# Altium schematic sheet FPGA_EEM_FMC_HA.SchDoc: Phaser
size 420 x 297 mm; EDA_Number: ARTIQ; Projet: ARTIQ/SINARA; Author: G.Kasprowicz; CompanyName: WUT ISE; DrawnBy: G.Kasprowicz; Organization: WUT ISE; Address1: PW ISE; Address2: Nowowiejska 15/19 00-665 Warsaw; Address3: gkasprow@gmail.com; DocumentNumber: 4; Revision: 2; SheetNumber: 4; SheetTotal: 18; ModifiedBy: -; CheckedDate: -; Title2: FPGA ADC; DivGrp: WUT ISE; Designer: G.Kasprowicz; ModifiedDate: -; ProjectName: Sensor Box
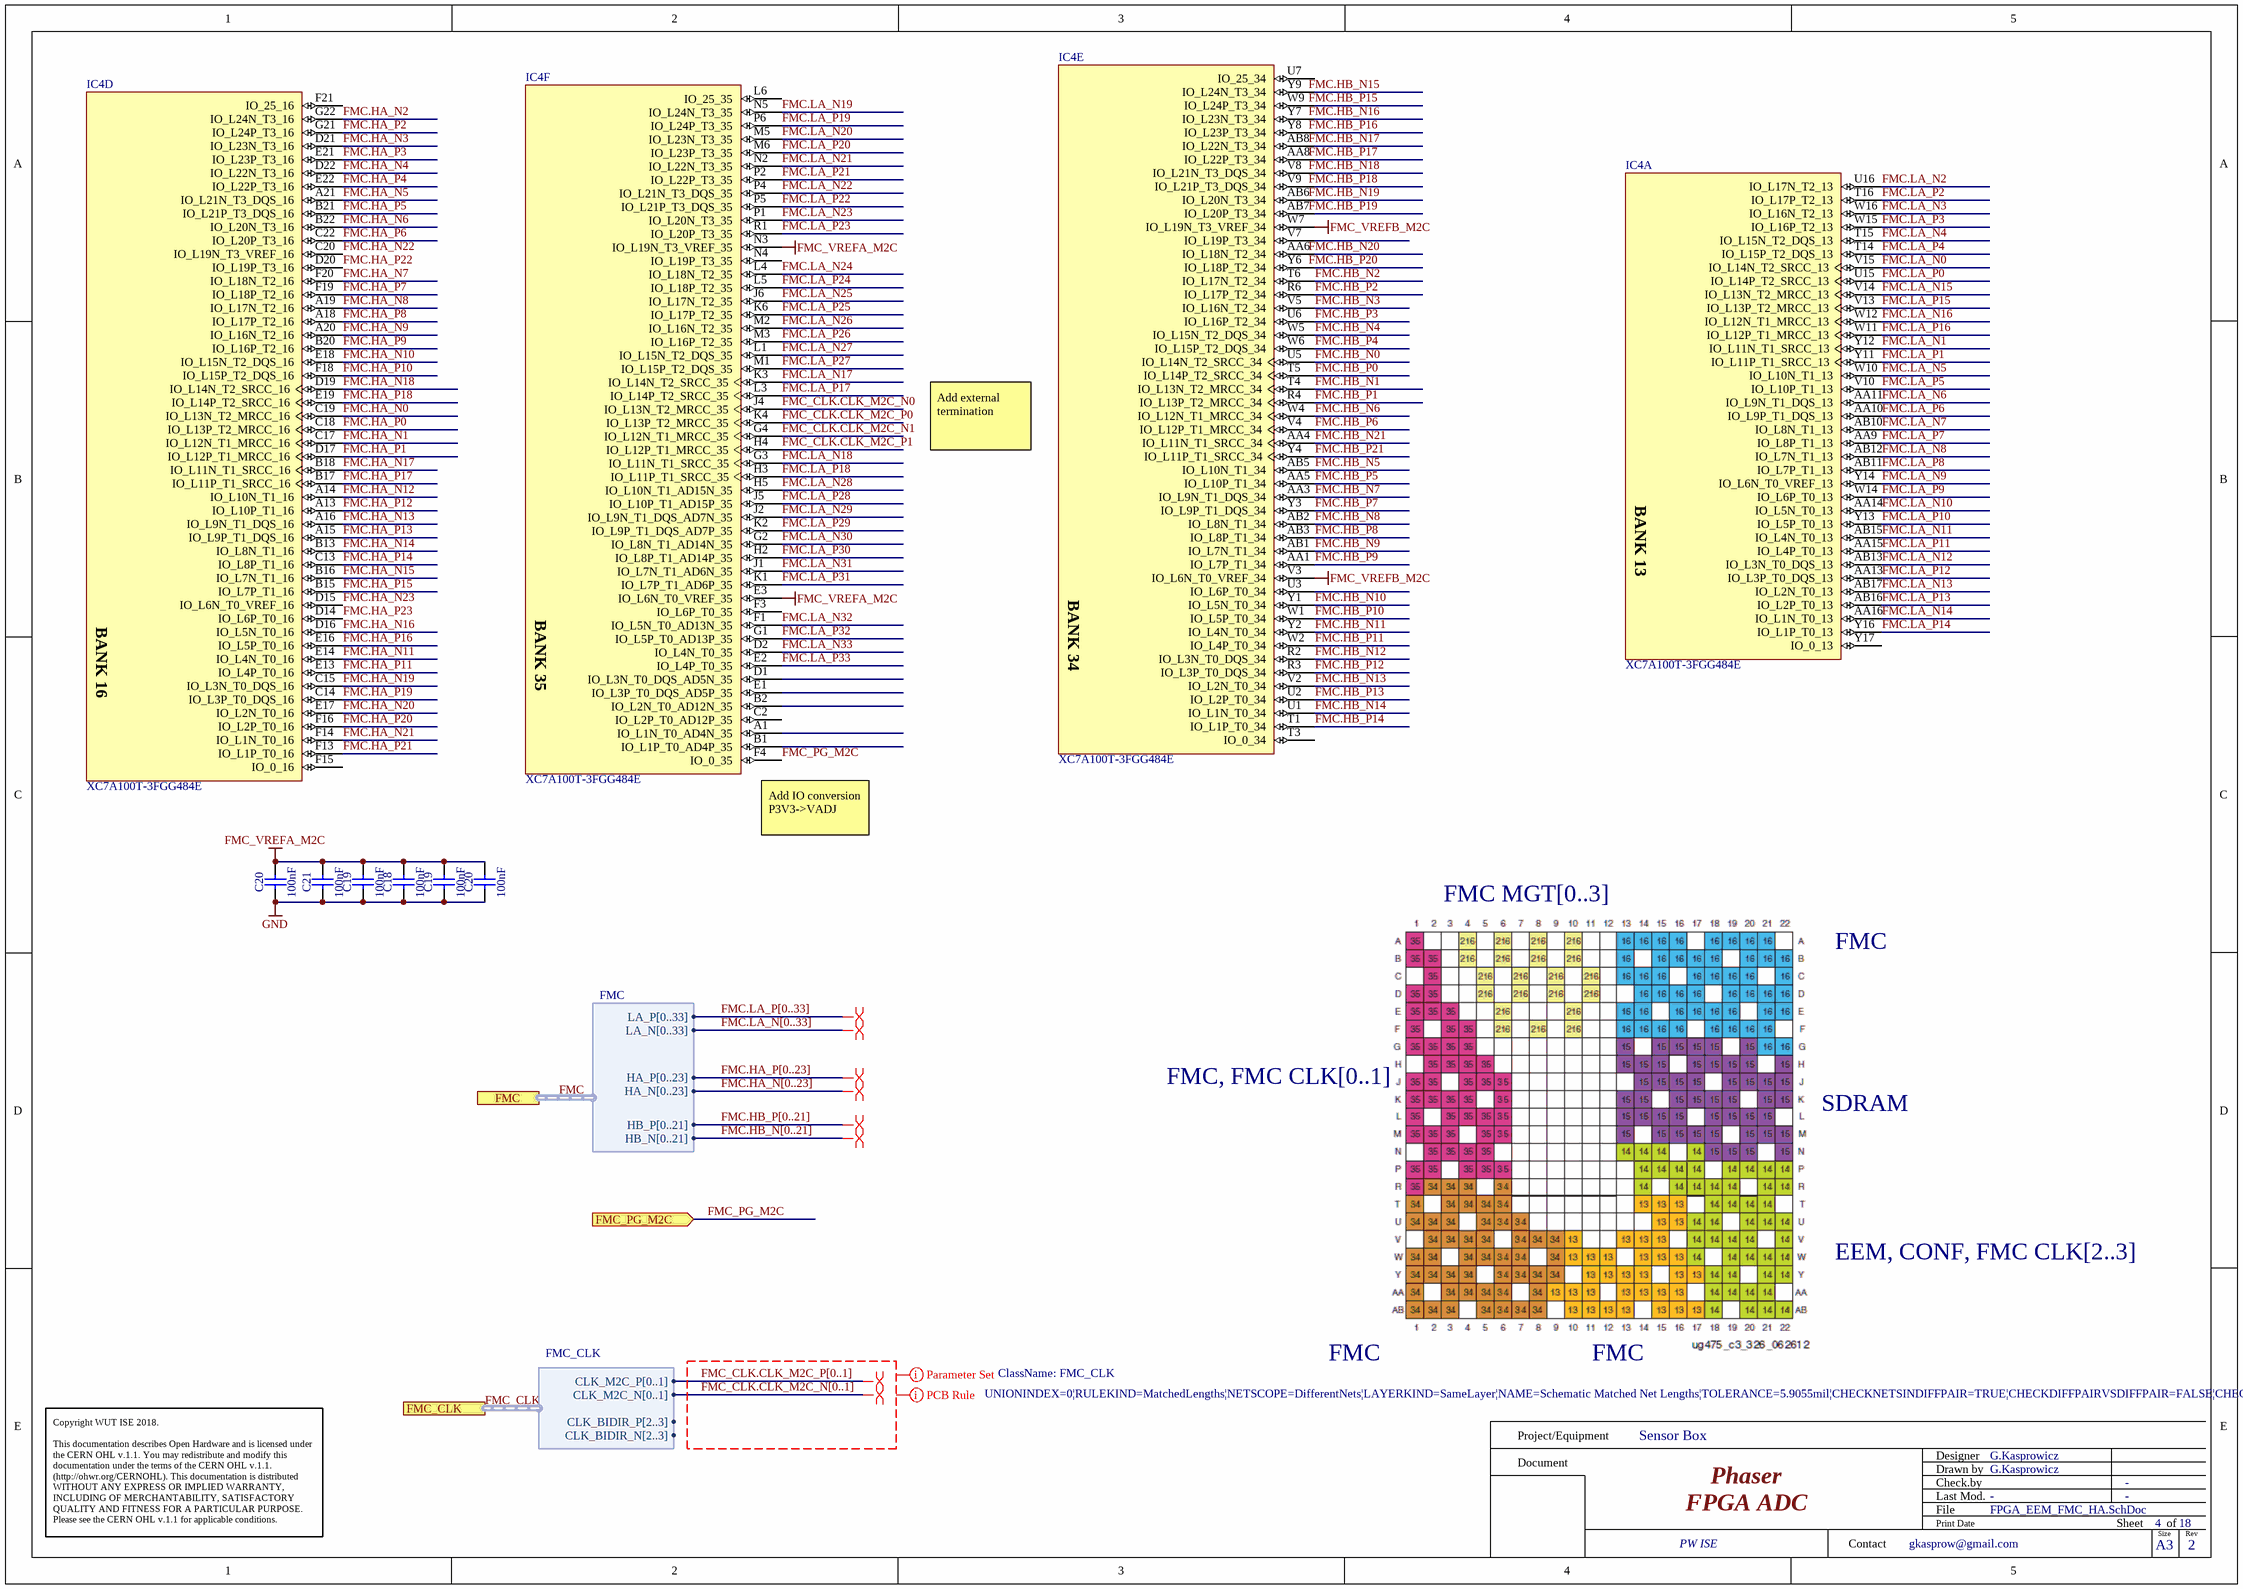
[diagram p0: FPGA_EEM_FMC_HA.SchDoc]

## Parts
(Parts that share a designator on the sheet are numbered #1, #2 ... from top to bottom, then left to right.)
C18  100nF  [CAPC0603X33N]
C19#1  100nF  [CAPC0603X33N]
C19#2  100nF  [CAPC0603X33N]
C20#1  100nF  [CAPC0603X33N]
C20#2  100nF  [CAPC0603X33N]
C21  100nF  [CAPC0603X33N]
IC4  XC7A100T-3FGG484E  [FGG484]  (parts A,D,E,F of 10)

## Ports
FMC (harness FMC), FMC_CLK (harness FMC_CLK), FMC_PG_M2C (in)

## Harnesses
FMC: LA_P[0..33], LA_N[0..33], HA_P[0..23], HA_N[0..23], HB_P[0..21], HB_N[0..21]
FMC_CLK: CLK_M2C_P[0..1], CLK_M2C_N[0..1], CLK_BIDIR_P[2..3], CLK_BIDIR_N[2..3]

## Nets
FMC_VREFA_M2C: C18.2 C19#1.2 C19#2.2 C20#1.2 C20#2.2 C21.2 IC4.E3(IO_L6N_T0_VREF_35) IC4.N3(IO_L19N_T3_VREF_35)
FMC_VREFB_M2C: IC4.V3(IO_L6N_T0_VREF_34) IC4.W7(IO_L19N_T3_VREF_34)
GND: C18.1 C19#1.1 C19#2.1 C20#1.1 C20#2.1 C21.1
FMC.HA_N0: IC4.C19(IO_L13N_T2_MRCC_16)
FMC.HA_N1: IC4.C17(IO_L12N_T1_MRCC_16)
FMC.HA_N2: IC4.G22(IO_L24N_T3_16)
FMC.HA_N3: IC4.D21(IO_L23N_T3_16)
FMC.HA_N4: IC4.D22(IO_L22N_T3_16)
FMC.HA_N5: IC4.A21(IO_L21N_T3_DQS_16)
FMC.HA_N6: IC4.B22(IO_L20N_T3_16)
FMC.HA_N7: IC4.F20(IO_L18N_T2_16)
FMC.HA_N8: IC4.A19(IO_L17N_T2_16)
FMC.HA_N9: IC4.A20(IO_L16N_T2_16)
FMC.HA_N10: IC4.E18(IO_L15N_T2_DQS_16)
FMC.HA_N11: IC4.E14(IO_L4N_T0_16)
FMC.HA_N12: IC4.A14(IO_L10N_T1_16)
FMC.HA_N13: IC4.A16(IO_L9N_T1_DQS_16)
FMC.HA_N14: IC4.B13(IO_L8N_T1_16)
FMC.HA_N15: IC4.B16(IO_L7N_T1_16)
FMC.HA_N16: IC4.D16(IO_L5N_T0_16)
FMC.HA_N17: IC4.B18(IO_L11N_T1_SRCC_16)
FMC.HA_N18: IC4.D19(IO_L14N_T2_SRCC_16)
FMC.HA_N19: IC4.C15(IO_L3N_T0_DQS_16)
FMC.HA_N20: IC4.E17(IO_L2N_T0_16)
FMC.HA_N21: IC4.F14(IO_L1N_T0_16)
FMC.HA_N22: IC4.C20(IO_L19N_T3_VREF_16)
FMC.HA_N23: IC4.D15(IO_L6N_T0_VREF_16)
FMC.HA_P0: IC4.C18(IO_L13P_T2_MRCC_16)
FMC.HA_P1: IC4.D17(IO_L12P_T1_MRCC_16)
FMC.HA_P2: IC4.G21(IO_L24P_T3_16)
FMC.HA_P3: IC4.E21(IO_L23P_T3_16)
FMC.HA_P4: IC4.E22(IO_L22P_T3_16)
FMC.HA_P5: IC4.B21(IO_L21P_T3_DQS_16)
FMC.HA_P6: IC4.C22(IO_L20P_T3_16)
FMC.HA_P7: IC4.F19(IO_L18P_T2_16)
FMC.HA_P8: IC4.A18(IO_L17P_T2_16)
FMC.HA_P9: IC4.B20(IO_L16P_T2_16)
FMC.HA_P10: IC4.F18(IO_L15P_T2_DQS_16)
FMC.HA_P11: IC4.E13(IO_L4P_T0_16)
FMC.HA_P12: IC4.A13(IO_L10P_T1_16)
FMC.HA_P13: IC4.A15(IO_L9P_T1_DQS_16)
FMC.HA_P14: IC4.C13(IO_L8P_T1_16)
FMC.HA_P15: IC4.B15(IO_L7P_T1_16)
FMC.HA_P16: IC4.E16(IO_L5P_T0_16)
FMC.HA_P17: IC4.B17(IO_L11P_T1_SRCC_16)
FMC.HA_P18: IC4.E19(IO_L14P_T2_SRCC_16)
FMC.HA_P19: IC4.C14(IO_L3P_T0_DQS_16)
FMC.HA_P20: IC4.F16(IO_L2P_T0_16)
FMC.HA_P21: IC4.F13(IO_L1P_T0_16)
FMC.HA_P22: IC4.D20(IO_L19P_T3_16)
FMC.HA_P23: IC4.D14(IO_L6P_T0_16)
FMC.HB_N0: IC4.U5(IO_L14N_T2_SRCC_34)
FMC.HB_N1: IC4.T4(IO_L13N_T2_MRCC_34)
FMC.HB_N2: IC4.T6(IO_L17N_T2_34)
FMC.HB_N3: IC4.V5(IO_L16N_T2_34)
FMC.HB_N4: IC4.W5(IO_L15N_T2_DQS_34)
FMC.HB_N5: IC4.AB5(IO_L10N_T1_34)
FMC.HB_N6: IC4.W4(IO_L12N_T1_MRCC_34)
FMC.HB_N7: IC4.AA3(IO_L9N_T1_DQS_34)
FMC.HB_N8: IC4.AB2(IO_L8N_T1_34)
FMC.HB_N9: IC4.AB1(IO_L7N_T1_34)
FMC.HB_N10: IC4.Y1(IO_L5N_T0_34)
FMC.HB_N11: IC4.Y2(IO_L4N_T0_34)
FMC.HB_N12: IC4.R2(IO_L3N_T0_DQS_34)
FMC.HB_N13: IC4.V2(IO_L2N_T0_34)
FMC.HB_N14: IC4.U1(IO_L1N_T0_34)
FMC.HB_N21: IC4.AA4(IO_L11N_T1_SRCC_34)
FMC.HB_P0: IC4.T5(IO_L14P_T2_SRCC_34)
FMC.HB_P1: IC4.R4(IO_L13P_T2_MRCC_34)
FMC.HB_P2: IC4.R6(IO_L17P_T2_34)
FMC.HB_P3: IC4.U6(IO_L16P_T2_34)
FMC.HB_P4: IC4.W6(IO_L15P_T2_DQS_34)
FMC.HB_P5: IC4.AA5(IO_L10P_T1_34)
FMC.HB_P6: IC4.V4(IO_L12P_T1_MRCC_34)
FMC.HB_P7: IC4.Y3(IO_L9P_T1_DQS_34)
FMC.HB_P8: IC4.AB3(IO_L8P_T1_34)
FMC.HB_P9: IC4.AA1(IO_L7P_T1_34)
FMC.HB_P10: IC4.W1(IO_L5P_T0_34)
FMC.HB_P11: IC4.W2(IO_L4P_T0_34)
FMC.HB_P12: IC4.R3(IO_L3P_T0_DQS_34)
FMC.HB_P13: IC4.U2(IO_L2P_T0_34)
FMC.HB_P14: IC4.T1(IO_L1P_T0_34)
FMC.HB_P21: IC4.Y4(IO_L11P_T1_SRCC_34)
FMC.LA_N0: IC4.V15(IO_L14N_T2_SRCC_13)
FMC.LA_N1: IC4.Y12(IO_L11N_T1_SRCC_13)
FMC.LA_N2: IC4.U16(IO_L17N_T2_13)
FMC.LA_N3: IC4.W16(IO_L16N_T2_13)
FMC.LA_N4: IC4.T15(IO_L15N_T2_DQS_13)
FMC.LA_N5: IC4.W10(IO_L10N_T1_13)
FMC.LA_N6: IC4.AA11(IO_L9N_T1_DQS_13)
FMC.LA_N7: IC4.AB10(IO_L8N_T1_13)
FMC.LA_N8: IC4.AB12(IO_L7N_T1_13)
FMC.LA_N9: IC4.Y14(IO_L6N_T0_VREF_13)
FMC.LA_N10: IC4.AA14(IO_L5N_T0_13)
FMC.LA_N11: IC4.AB15(IO_L4N_T0_13)
FMC.LA_N12: IC4.AB13(IO_L3N_T0_DQS_13)
FMC.LA_N13: IC4.AB17(IO_L2N_T0_13)
FMC.LA_N14: IC4.AA16(IO_L1N_T0_13)
FMC.LA_N15: IC4.V14(IO_L13N_T2_MRCC_13)
FMC.LA_N16: IC4.W12(IO_L12N_T1_MRCC_13)
FMC.LA_N17: IC4.K3(IO_L14N_T2_SRCC_35)
FMC.LA_N18: IC4.G3(IO_L11N_T1_SRCC_35)
FMC.LA_N19: IC4.N5(IO_L24N_T3_35)
FMC.LA_N20: IC4.M5(IO_L23N_T3_35)
FMC.LA_N21: IC4.N2(IO_L22N_T3_35)
FMC.LA_N22: IC4.P4(IO_L21N_T3_DQS_35)
FMC.LA_N23: IC4.P1(IO_L20N_T3_35)
FMC.LA_N24: IC4.L4(IO_L18N_T2_35)
FMC.LA_N25: IC4.J6(IO_L17N_T2_35)
FMC.LA_N26: IC4.M2(IO_L16N_T2_35)
FMC.LA_N27: IC4.L1(IO_L15N_T2_DQS_35)
FMC.LA_N28: IC4.H5(IO_L10N_T1_AD15N_35)
FMC.LA_N29: IC4.J2(IO_L9N_T1_DQS_AD7N_35)
FMC.LA_N30: IC4.G2(IO_L8N_T1_AD14N_35)
FMC.LA_N31: IC4.J1(IO_L7N_T1_AD6N_35)
FMC.LA_N32: IC4.F1(IO_L5N_T0_AD13N_35)
FMC.LA_N33: IC4.D2(IO_L4N_T0_35)
FMC.LA_P0: IC4.U15(IO_L14P_T2_SRCC_13)
FMC.LA_P1: IC4.Y11(IO_L11P_T1_SRCC_13)
FMC.LA_P2: IC4.T16(IO_L17P_T2_13)
FMC.LA_P3: IC4.W15(IO_L16P_T2_13)
FMC.LA_P4: IC4.T14(IO_L15P_T2_DQS_13)
FMC.LA_P5: IC4.V10(IO_L10P_T1_13)
FMC.LA_P6: IC4.AA10(IO_L9P_T1_DQS_13)
FMC.LA_P7: IC4.AA9(IO_L8P_T1_13)
FMC.LA_P8: IC4.AB11(IO_L7P_T1_13)
FMC.LA_P9: IC4.W14(IO_L6P_T0_13)
FMC.LA_P10: IC4.Y13(IO_L5P_T0_13)
FMC.LA_P11: IC4.AA15(IO_L4P_T0_13)
FMC.LA_P12: IC4.AA13(IO_L3P_T0_DQS_13)
FMC.LA_P13: IC4.AB16(IO_L2P_T0_13)
FMC.LA_P14: IC4.Y16(IO_L1P_T0_13)
FMC.LA_P15: IC4.V13(IO_L13P_T2_MRCC_13)
FMC.LA_P16: IC4.W11(IO_L12P_T1_MRCC_13)
FMC.LA_P17: IC4.L3(IO_L14P_T2_SRCC_35)
FMC.LA_P18: IC4.H3(IO_L11P_T1_SRCC_35)
FMC.LA_P19: IC4.P6(IO_L24P_T3_35)
FMC.LA_P20: IC4.M6(IO_L23P_T3_35)
FMC.LA_P21: IC4.P2(IO_L22P_T3_35)
FMC.LA_P22: IC4.P5(IO_L21P_T3_DQS_35)
FMC.LA_P23: IC4.R1(IO_L20P_T3_35)
FMC.LA_P24: IC4.L5(IO_L18P_T2_35)
FMC.LA_P25: IC4.K6(IO_L17P_T2_35)
FMC.LA_P26: IC4.M3(IO_L16P_T2_35)
FMC.LA_P27: IC4.M1(IO_L15P_T2_DQS_35)
FMC.LA_P28: IC4.J5(IO_L10P_T1_AD15P_35)
FMC.LA_P29: IC4.K2(IO_L9P_T1_DQS_AD7P_35)
FMC.LA_P30: IC4.H2(IO_L8P_T1_AD14P_35)
FMC.LA_P31: IC4.K1(IO_L7P_T1_AD6P_35)
FMC.LA_P32: IC4.G1(IO_L5P_T0_AD13P_35)
FMC.LA_P33: IC4.E2(IO_L4P_T0_35)
FMC_CLK.CLK_M2C_N0: IC4.J4(IO_L13N_T2_MRCC_35)
FMC_CLK.CLK_M2C_N1: IC4.G4(IO_L12N_T1_MRCC_35)
FMC_CLK.CLK_M2C_P0: IC4.K4(IO_L13P_T2_MRCC_35)
FMC_CLK.CLK_M2C_P1: IC4.H4(IO_L12P_T1_MRCC_35)
FMC_PG_M2C: IC4.F4(IO_0_35) ; port FMC_PG_M2C

Not connected (* = marked no-connect by the designer): IC4 A1(IO_L1N_T0_AD4N_35) AA6(IO_L18N_T2_34) AA8(IO_L22P_T3_34) AB6(IO_L20N_T3_34) AB7(IO_L20P_T3_34) AB8(IO_L22N_T3_34) B1(IO_L1P_T0_AD4P_35) B2(IO_L2N_T0_AD12N_35) C2(IO_L2P_T0_AD12P_35) D1(IO_L3N_T0_DQS_AD5N_35) E1(IO_L3P_T0_DQS_AD5P_35) F3(IO_L6P_T0_35) F15(IO_0_16) F21(IO_25_16) L6(IO_25_35) N4(IO_L19P_T3_35) T3(IO_0_34) U3(IO_L6P_T0_34) U7(IO_25_34) V7(IO_L19P_T3_34) V8(IO_L21N_T3_DQS_34) V9(IO_L21P_T3_DQS_34) W9(IO_L24P_T3_34) Y6(IO_L18P_T2_34) Y7(IO_L23N_T3_34) Y8(IO_L23P_T3_34) Y9(IO_L24N_T3_34) Y17(IO_0_13)

## Buses and harness runs
bus FMC.HA_N[0..23]
bus FMC.HA_P[0..23]
bus FMC.HB_N[0..21]
bus FMC.HB_P[0..21]
bus FMC.LA_N[0..33]
bus FMC.LA_P[0..33]
bus FMC_CLK.CLK_M2C_N[0..1]
bus FMC_CLK.CLK_M2C_P[0..1]
harness FMC = port FMC
harness FMC_CLK = port FMC_CLK

## Layout directives
differential pair; differential pair class FMC_LA: (no net found under the mark)
differential pair; differential pair class FMC_HA: (no net found under the mark)
differential pair; differential pair class FMC_HB: (no net found under the mark)
net class FMC_CLK: FMC_CLK.CLK_M2C_N[0..1], FMC_CLK.CLK_M2C_P[0..1]
rule Matched Net Lengths [Delay Tolerance = 11ps]: FMC_CLK.CLK_M2C_N[0..1], FMC_CLK.CLK_M2C_P[0..1]
differential pair: FMC_CLK.CLK_M2C_N[0..1], FMC_CLK.CLK_M2C_P[0..1]

## Notes on the sheet
- Add external termination
- (near IC4) Add IO conversion P3V3->VADJ
- FMC MGT[0..3]
- FMC
- FMC, FMC CLK[0..1]
- SDRAM
- EEM, CONF, FMC CLK[2..3]
- Labels drawn without touching a wire or pin: FMC.HB_N15, FMC.HB_N16, FMC.HB_N17, FMC.HB_N18, FMC.HB_N19, FMC.HB_N20, FMC.HB_P15, FMC.HB_P16, FMC.HB_P17, FMC.HB_P18, FMC.HB_P19, FMC.HB_P20
- Project/Equipment
- Document
- Designer
- Drawn by
- Check.by
- Copyright WUT ISE 2018.
  This documentation describes Open Hardware and is licensed under the CERN OHL v.1.1. You may redistribute and modify this documentation under the terms of the CERN OHL v.1.1. (http://ohwr.org/CERNOHL). This documentation is distributed WITHOUT ANY EXPRESS OR IMPLIED WARRANTY, INCLUDING OF MERCHANTABILITY, SATISFACTORY QUALITY AND FITNESS FOR A PARTICULAR PURPOSE. Please see the CERN OHL v.1.1 for applicable conditions.
- Contact
- File
- Last Mod.
- Print Date
- Sheet
- Size
- A3
- of
- Rev
- (in symbol CMP-0364-00028-3, part A) BANK 13
- (in symbol CMP-0364-00028-3, part D) BANK 16
- (in symbol CMP-0364-00028-3, part E) BANK 34
- (in symbol CMP-0364-00028-3, part F) BANK 35

## Library data of the parts
C18 C19#1 C19#2 C20#1 C20#2 C21 = CC0201_100NF_6.3V_10%_X5R: Non-polarised capacitor; Part Description: SMD Multilayer Chip Ceramic Capacitor; Manufacturer: GENERIC; Manufacturer1 Part Number: 02016D104KAT2A; Voltage: 6.3V; TC: X5R; Tolerance: ±10%; Table: Capacitors SMD; Part Number: CC0201_100NF_6.3V_10%_X5R; Component Kind: Standard; Component Type: Standard; Pin Count: 2; Value: 100nF; Status: Not Recommended; Manufacturer Part Number: CC0201_100NF_6.3V_10%_X5R; Case: 0201; Mounted: Yes; Socket: No; SMD: Yes; Manufacturer1 Example: AVX; Manufacturer1 ComponentHeight: 0.33mm; HelpURL: \\cern.ch\dfs\Applications\Altium\Datasheets\CC0201_X5R_AVX.pdf; Author: CERN DEM JLC; CreateDate: 2007-12-03; LatestRevisionDate: 2007-12-03
IC4 = CMP-0364-00028-3: Artix-7 FPGA, 285 User I/Os, 4 GTP, 484-Ball BGA, Speed Grade 3, Extended Grade, Pb-Free; Manufacturer: Xilinx; Max User I/O: 300; Clock Mgmt Tiles (CMTs): 6; Logic Cells: 101440; Block RAM Blocks (36Kb): 135; Block RAM Blocks (18Kb): 270; Speed Grade: -3; CLBs (Slices): 15850; Block RAM Blocks (Max Kb): 4860; DSP48E1 Slices: 240; RoHS: Pb-Free; ComponentLink3URL: http://www.xilinx.com/support/documentation/data_sheets/ds181_Artix_7_Data_Sheet.pdf; NexusDeviceID: XC7A100T-3FGG484E; DatasheetVersion: v1.12; Mounting Technology: Surface Mount; PackageDescription: Wire-Bond Fine-Pitch BGA, Body 23 x 23 mm, 1.0 mm Pitch; PackageReference: FGG484; ComponentLink2Description: Package Specification; Code_JEDEC: MS-034-AAJ-1; ComponentLink2URL: http://www.xilinx.com/support/documentation/user_guides/ug475_7Series_Pkg_Pinout.pdf; ComponentLink3Description: DC and Switching Characteristics; Generic Part Number: XC7A100T; ComponentLink4Description: Package File; ComponentLink4URL: http://www.xilinx.com/support/packagefiles/a7packages/xc7a100tfgg484pkg.txt; ComponentLink1URL: http://www.xilinx.com/support/documentation/data_sheets/ds180_7Series_Overview.pdf; PartNumber: XC7A100T-3FGG484E; ComponentLink5URL: http://www.xilinx.com/support/documentation/user_guides/ug475_7Series_Pkg_Pinout.pdf; PackageVersion: Rev 1.8; ComponentLink5Description: Packaging and Pinout; ComponentLink1Description: Datasheet; CLBs (Max Distributed RAM Kb): 1188